# Altium schematic sheet PMIC_Block_.SchDoc
size A3; SheetNumber: 11; SheetTotal: 26
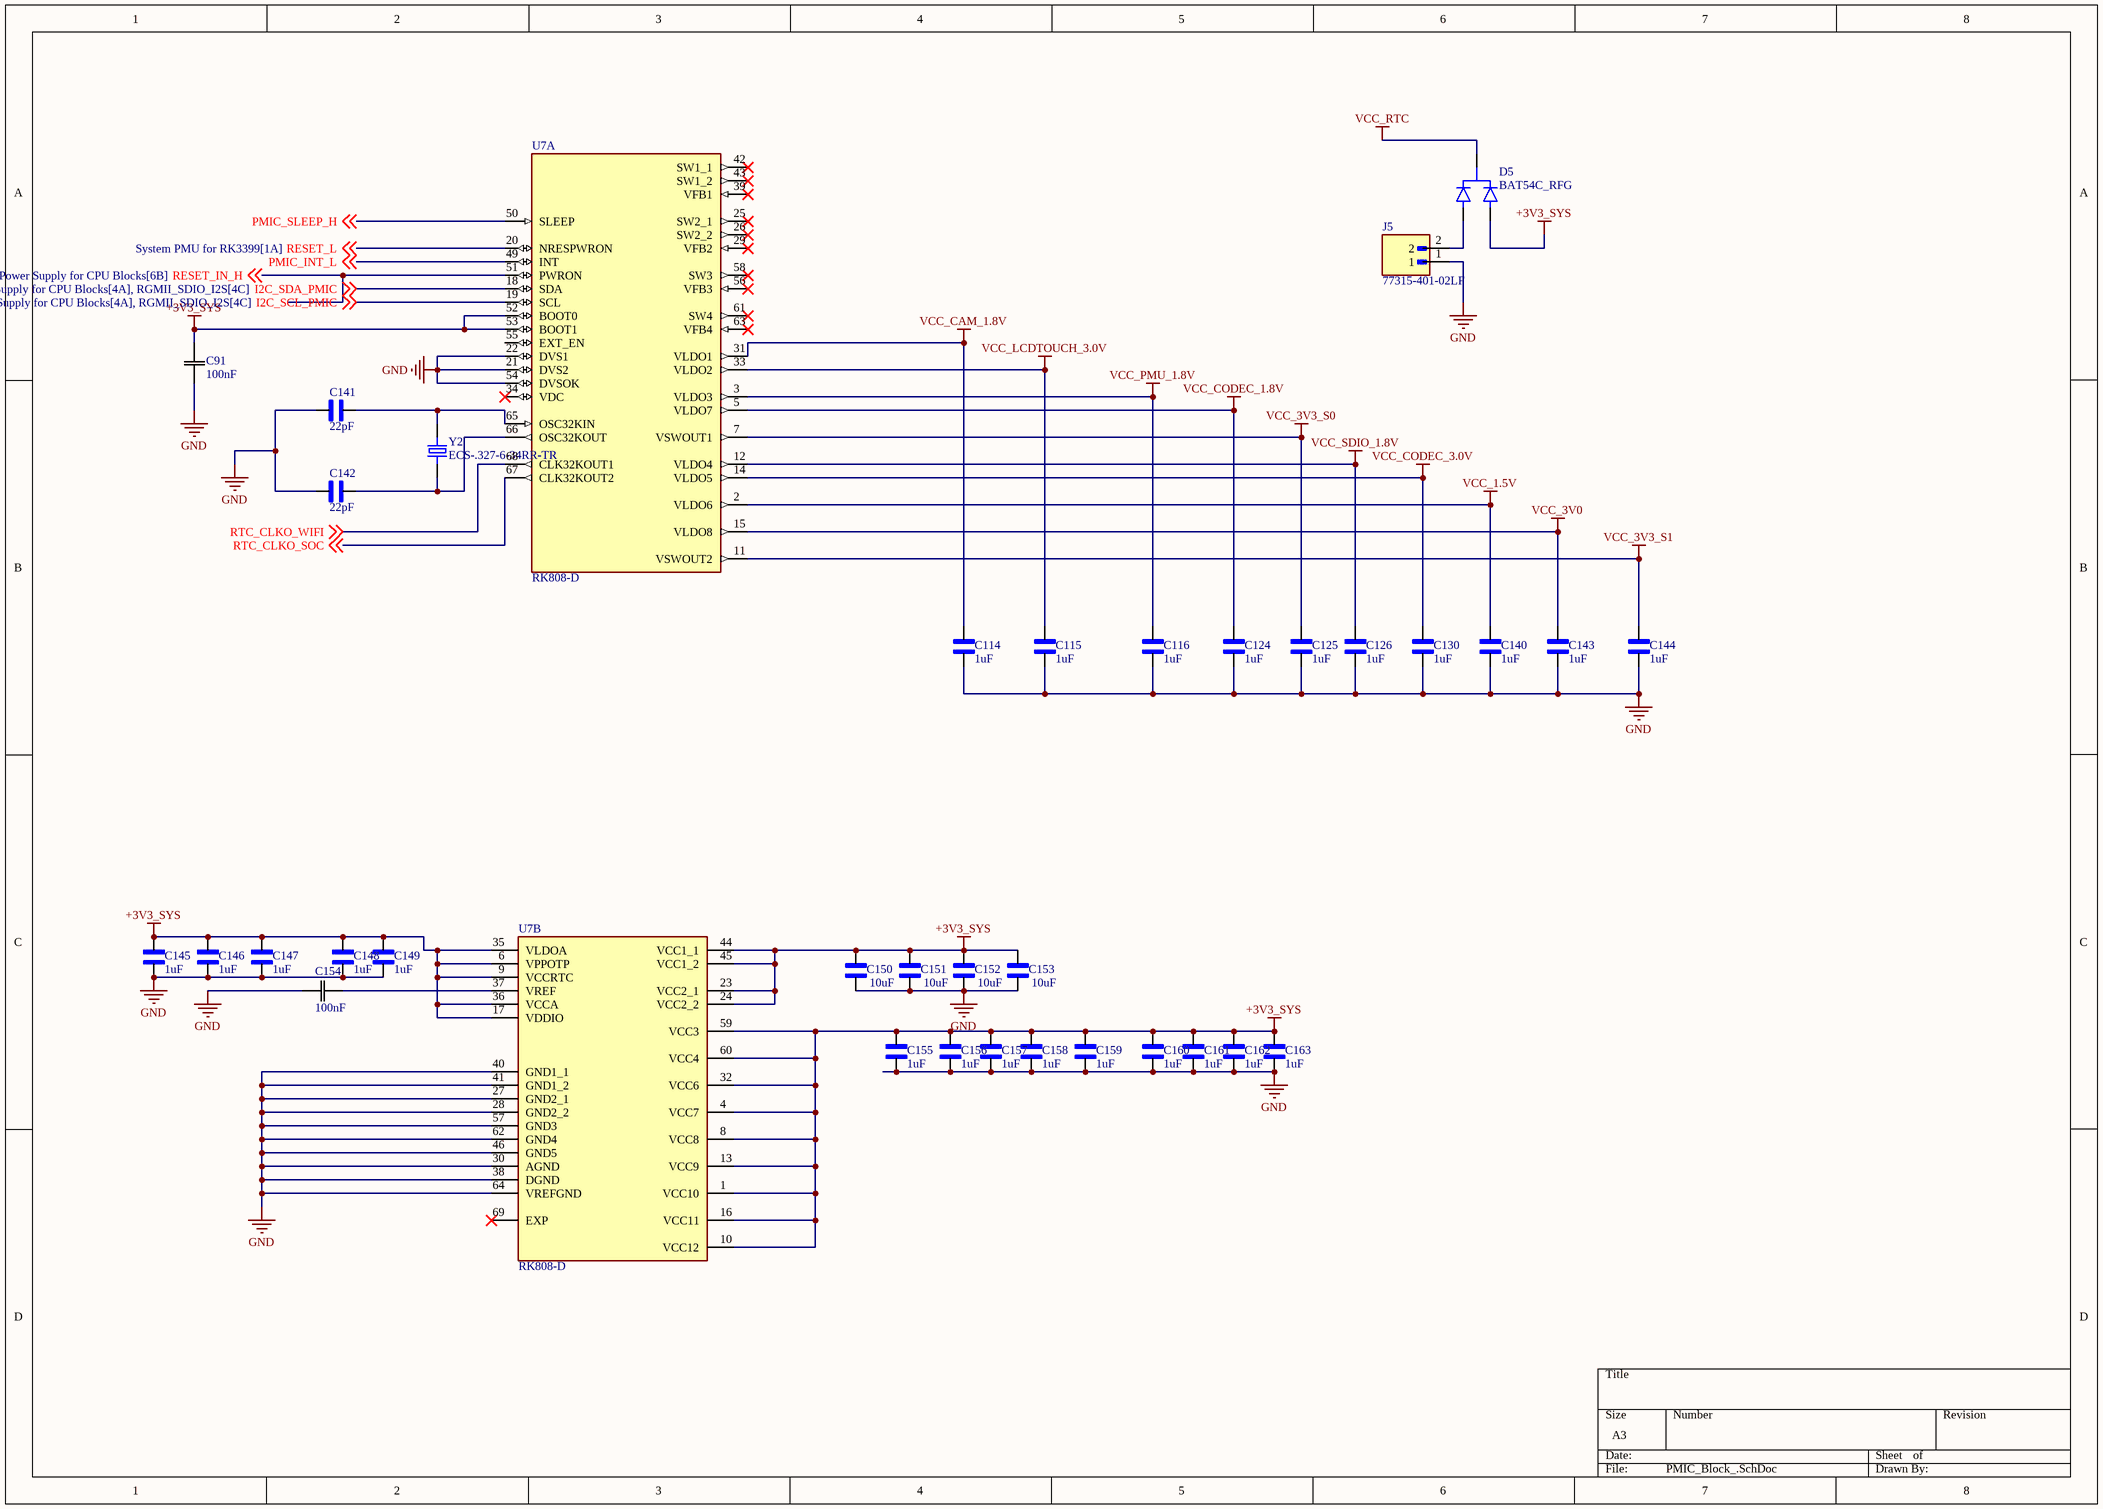
[diagram p0: PMIC_Block_.SchDoc]

## Parts
C91  100nF  [CAP_1005_TDK]
C114  1uF  [CAPC1005X56N]
C115  1uF  [CAPC1005X56N]
C116  1uF  [CAPC1005X56N]
C124  1uF  [CAPC1005X56N]
C125  1uF  [CAPC1005X56N]
C126  1uF  [CAPC1005X56N]
C130  1uF  [CAPC1005X56N]
C140  1uF  [CAPC1005X56N]
C141  22pF  [CAPC2012X140N]
C142  22pF  [CAPC2012X140N]
C143  1uF  [CAPC1005X56N]
C144  1uF  [CAPC1005X56N]
C145  1uF  [CAPC1005X56N]
C146  1uF  [CAPC1005X56N]
C147  1uF  [CAPC1005X56N]
C148  1uF  [CAPC1005X56N]
C149  1uF  [CAPC1005X56N]
C150  10uF  [CAPC1005X70N]
C151  10uF  [CAPC1005X70N]
C152  10uF  [CAPC1005X70N]
C153  10uF  [CAPC1005X70N]
C154  100nF  [CAP_1005_TDK]
C155  1uF  [CAPC1005X56N]
C156  1uF  [CAPC1005X56N]
C157  1uF  [CAPC1005X56N]
C158  1uF  [CAPC1005X56N]
C159  1uF  [CAPC1005X56N]
C160  1uF  [CAPC1005X56N]
C161  1uF  [CAPC1005X56N]
C162  1uF  [CAPC1005X56N]
C163  1uF  [CAPC1005X56N]
D5  BAT54C_RFG  [SOT95P237X112-3N]
J5  77315-401-02LF  [AMPHENOL_77315-401-02LF]
U7  RK808-D  [QFN35P700X700X80-69N]  (parts A,B of 2)
Y2  ECS-.327-6-34RR-TR  [XTAL_ECS-.327-6-34RR-TR]

## Nets
+3V3_SYS: C91.2 C145.2 C146.2 C147.2 C148.2 C149.2 C150.2 C151.2 C152.2 C153.2 C155.2 C156.2 C157.2 C158.2 C159.2 C160.2 C161.2 C162.2 C163.2 D5.2 U7.1(VCC10) U7.4(VCC7) U7.6(VPPOTP) U7.8(VCC8) U7.9(VCCRTC) U7.10(VCC12) U7.13(VCC9) U7.16(VCC11) U7.17(VDDIO) U7.23(VCC2_1) U7.24(VCC2_2) U7.32(VCC6) U7.35(VLDOA) U7.36(VCCA) U7.44(VCC1_1) U7.45(VCC1_2) U7.52(BOOT0) U7.53(BOOT1) U7.59(VCC3) U7.60(VCC4)
GND: C91.1 C114.1 C115.1 C116.1 C124.1 C125.1 C126.1 C130.1 C140.1 C141.2 C142.2 C143.1 C144.1 C145.1 C146.1 C147.1 C148.1 C149.1 C150.1 C151.1 C152.1 C153.1 C154.2 C155.1 C156.1 C157.1 C158.1 C159.1 C160.1 C161.1 C162.1 C163.1 J5.1 U7.21(DVS2) U7.22(DVS1) U7.27(GND2_1) U7.28(GND2_2) U7.30(AGND) U7.38(DGND) U7.40(GND1_1) U7.41(GND1_2) U7.46(GND5) U7.54(DVSOK) U7.57(GND3) U7.62(GND4) U7.64(VREFGND)
VCC_1.5V: C140.2 U7.2(VLDO6)
VCC_3V0: C143.2 U7.15(VLDO8)
VCC_3V3_S0: C125.2 U7.7(VSWOUT1)
VCC_3V3_S1: C144.2 U7.11(VSWOUT2)
VCC_CAM_1.8V: C114.2 U7.31(VLDO1)
VCC_CODEC_1.8V: C124.2 U7.5(VLDO7)
VCC_CODEC_3.0V: C130.2 U7.14(VLDO5)
VCC_LCDTOUCH_3.0V: C115.2 U7.33(VLDO2)
VCC_PMU_1.8V: C116.2 U7.3(VLDO3)
VCC_RTC: D5.3
VCC_SDIO_1.8V: C126.2 U7.12(VLDO4)
I2C_SCL_PMIC: U7.19(SCL) ; off-sheet I2C_SCL_PMIC
I2C_SDA_PMIC: U7.18(SDA) ; off-sheet I2C_SDA_PMIC
PMIC_INT_L: U7.49(INT) ; off-sheet PMIC_INT_L
PMIC_SLEEP_H: U7.50(SLEEP) ; off-sheet PMIC_SLEEP_H
RESET_IN_H: U7.51(PWRON) ; off-sheet RESET_IN_H
RESET_L: U7.20(NRESPWRON) ; off-sheet RESET_L
RTC_CLKO_SOC: U7.67(CLK32KOUT2) ; off-sheet RTC_CLKO_SOC
RTC_CLKO_WIFI: U7.68(CLK32KOUT1) ; off-sheet RTC_CLKO_WIFI
NetC141_1: C141.1 U7.65(OSC32KIN) Y2.2(O/I)
NetC142_1: C142.1 U7.66(OSC32KOUT) Y2.1(I/O)
NetC154_1: C154.1 U7.37(VREF)
NetD5_1: D5.1 J5.2

Not connected (* = marked no-connect by the designer): U7 25(SW2_1)* 26(SW2_2)* 29(VFB2)* 34(VDC)* 39(VFB1)* 42(SW1_1)* 43(SW1_2)* 55(EXT_EN) 56(VFB3)* 58(SW3)* 61(SW4)* 63(VFB4)* 69(EXP)*

## Library data of the parts
C91 C154 = C1005X7R1H104M050BB: Description; Manufacturer_Name: TDK; Copyright: Copyright (C) 2025 Ultra Librarian. All rights reserved.; Manufacturer_Part_Number: C1005X7R1H104M050BB
C114-C116 C124-C126 C130 C140 C143-C149 C155-C163 = 0402ZD105KAT4A: 1 ÂµF Â±10% 10V Ceramic Capacitor X5R 0402 (1005 Metric); MF: AVX; SnapEDA_Link: https://www.snapeda.com/parts/0402ZD105KAT4A/AVX/view-part/?ref=snap; Package: 1005 AVX; Value: *; MP: 0402ZD105KAT4A; Check_prices: https://www.snapeda.com/parts/0402ZD105KAT4A/AVX/view-part/?ref=eda
C141 C142 = C0805C220J5GACTU: Capacitor, Ceramic, Cap, 22.0pF, Tol 5%, SMT, 50V, C0G | KEMET C0805C220J5GACTU; SnapEDA_Link: https://www.snapeda.com/parts/C0805C220J5GACTU/KEMET/view-part/?ref=snap; Package: 0805 Kemet; Value: *; MF: KEMET; MP: C0805C220J5GACTU; Check_prices: https://www.snapeda.com/parts/C0805C220J5GACTU/KEMET/view-part/?ref=eda
C150-C153 = CL05A106MQ5NUNC: 10 ÂµF Â±20% 6.3V Ceramic Capacitor X5R 0402 (1005 Metric); MF: Samsung; SnapEDA_Link: https://www.snapeda.com/parts/CL05A106MQ5NUNC/Samsung/view-part/?ref=snap; Package: SMD-2 Samsung; Value: *; MP: CL05A106MQ5NUNC; Check_prices: https://www.snapeda.com/parts/CL05A106MQ5NUNC/Samsung/view-part/?ref=eda
D5 = BAT54C_RFG: SOT-23, 30V, 0.2A, Schottky Diode; MF: Taiwan Semiconductor; MP: BAT54C RF; SnapEDA_Link: https://www.snapeda.com/parts/BAT54C%20RF/Taiwan+Semiconductor/view-part/?ref=snap; Package: SOT-23 Taiwan Semiconductor; Value: *; Check_prices: https://www.snapeda.com/parts/BAT54C%20RF/Taiwan+Semiconductor/view-part/?ref=eda
U7 = RK808-D: RK808-D Power Management IC; MF: rockchip; SnapEDA_Link: https://www.snapeda.com/parts/RK808-D/Rockchip/view-part/?ref=snap; Package: None; Value: *; MP: RK808-D; Check_prices: https://www.snapeda.com/parts/RK808-D/Rockchip/view-part/?ref=eda
Y2 = ECS-.327-6-34RR-TR: 32.768kHz 20ppm Crystal 6pF 20 kOhm -40C ~ 85C Surface Mount 2-SMD, No Lead 3.2 x 1.5; MF: ECS Inc.; SnapEDA_Link: https://www.snapeda.com/parts/ECS-.327-6-34RR-TR/ECS/view-part/?ref=snap; Package: ECX-34RR-34RR-2 ECS; Value: *; MP: ECS-.327-6-34RR-TR; Check_prices: https://www.snapeda.com/parts/ECS-.327-6-34RR-TR/ECS/view-part/?ref=eda
J5 = 77315-401-02LF: Package: None; Price: None; Value: *; MP: 77315-401-02LF; Availability: Unavailable